# Altium project YYBpcb.PrjPcb
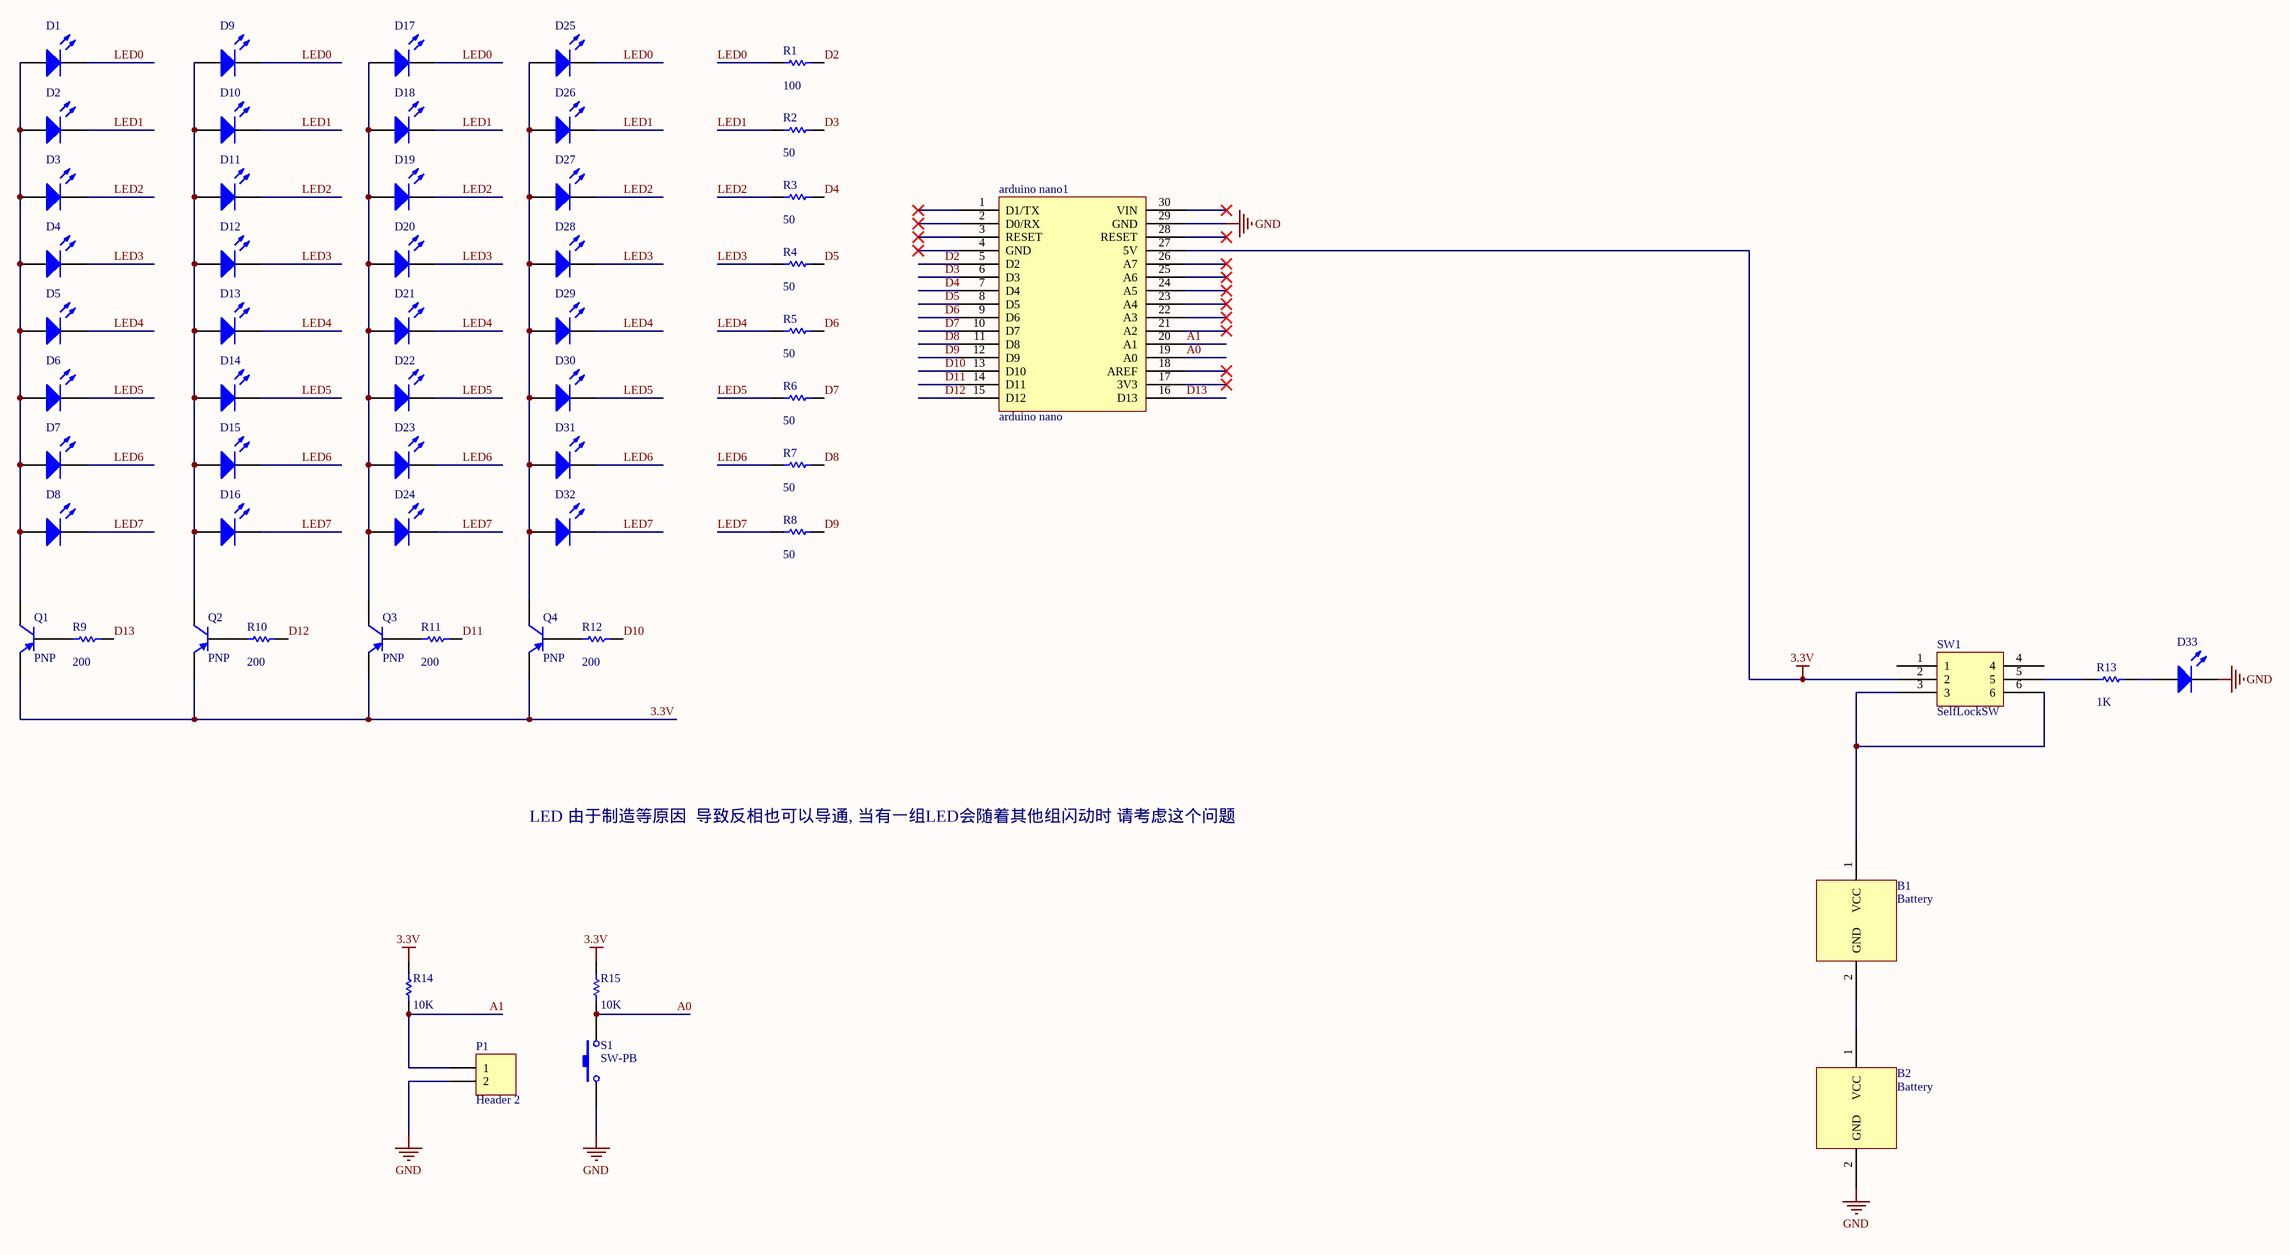
[diagram p0: Sheet3.SchDoc]
1 sheet, 58 parts. Net scope: global (net labels, ports and power ports of the same name join across sheets).
Board file: PCB1.PcbDoc

## Sheet Sheet3.SchDoc
size A2

### Parts
arduino_nano1  arduino nano  [arduino nano - duplicate]
B1  Battery  [battery]
B2  Battery  [battery]
D1  LED3  [3.5X2.8X1.9]  (value not drawn)
D2  LED3  [3.5X2.8X1.9]  (value not drawn)
D3  LED3  [3.5X2.8X1.9]  (value not drawn)
D4  LED3  [3.5X2.8X1.9]  (value not drawn)
D5  LED3  [3.5X2.8X1.9]  (value not drawn)
D6  LED3  [3.5X2.8X1.9]  (value not drawn)
D7  LED3  [3.5X2.8X1.9]  (value not drawn)
D8  LED3  [3.5X2.8X1.9]  (value not drawn)
D9  LED3  [3.5X2.8X1.9]  (value not drawn)
D10  LED3  [3.5X2.8X1.9]  (value not drawn)
D11  LED3  [3.5X2.8X1.9]  (value not drawn)
D12  LED3  [3.5X2.8X1.9]  (value not drawn)
D13  LED3  [3.5X2.8X1.9]  (value not drawn)
D14  LED3  [3.5X2.8X1.9]  (value not drawn)
D15  LED3  [3.5X2.8X1.9]  (value not drawn)
D16  LED3  [3.5X2.8X1.9]  (value not drawn)
D17  LED3  [3.5X2.8X1.9]  (value not drawn)
D18  LED3  [3.5X2.8X1.9]  (value not drawn)
D19  LED3  [3.5X2.8X1.9]  (value not drawn)
D20  LED3  [3.5X2.8X1.9]  (value not drawn)
D21  LED3  [3.5X2.8X1.9]  (value not drawn)
D22  LED3  [3.5X2.8X1.9]  (value not drawn)
D23  LED3  [3.5X2.8X1.9]  (value not drawn)
D24  LED3  [3.5X2.8X1.9]  (value not drawn)
D25  LED3  [3.5X2.8X1.9]  (value not drawn)
D26  LED3  [3.5X2.8X1.9]  (value not drawn)
D27  LED3  [3.5X2.8X1.9]  (value not drawn)
D28  LED3  [3.5X2.8X1.9]  (value not drawn)
D29  LED3  [3.5X2.8X1.9]  (value not drawn)
D30  LED3  [3.5X2.8X1.9]  (value not drawn)
D31  LED3  [3.5X2.8X1.9]  (value not drawn)
D32  LED3  [3.5X2.8X1.9]  (value not drawn)
D33  LED3  [6-0805_N]  (value not drawn)
P1  Header 2  [HDR1X2]
Q1  PNP  [LC-SOT-23(SOT-23-3)]
Q2  PNP  [LC-SOT-23(SOT-23-3)]
Q3  PNP  [LC-SOT-23(SOT-23-3)]
Q4  PNP  [LC-SOT-23(SOT-23-3)]
R1  value 100  [6-0805_N]
R2  value 50  [6-0805_N]
R3  value 50  [6-0805_N]
R4  value 50  [6-0805_N]
R5  value 50  [6-0805_N]
R6  value 50  [6-0805_N]
R7  value 50  [6-0805_N]
R8  value 50  [6-0805_N]
R9  value 200  [6-0805_N]
R10  value 200  [6-0805_N]
R11  value 200  [6-0805_N]
R12  value 200  [6-0805_N]
R13  value 1K  [6-0805_N]
R14  value 10K  [6-0805_N]
R15  value 10K  [6-0805_N]
S1  SW-PB  [贴片开关]
SW1  SelfLockSW  [sw0 - duplicate]

### Nets
3.3V: arduino_nano1.27(5V) Q1.3(C) Q2.3(B) Q3.3(B) Q4.3(B) R14.2 R15.2 SW1.2
GND: arduino_nano1.29(GND) B2.2(GND) D33.2(K) P1.2 S1.1
A0: arduino_nano1.19(A0) R15.1 S1.2
A1: arduino_nano1.20(A1) P1.1 R14.1
D2: arduino_nano1.5(D2) R1.2
D3: arduino_nano1.6(D3) R2.2
D4: arduino_nano1.7(D4) R3.2
D5: arduino_nano1.8(D5) R4.2
D6: arduino_nano1.9(D6) R5.2
D7: arduino_nano1.10(D7) R6.2
D8: arduino_nano1.11(D8) R7.2
D9: arduino_nano1.12(D9) R8.2
D10: arduino_nano1.13(D10) R12.2
D11: arduino_nano1.14(D11) R11.2
D12: arduino_nano1.15(D12) R10.2
D13: arduino_nano1.16(D13) R9.2
LED0: D1.2(K) D9.2(K) D17.2(K) D25.2(K) R1.1
LED1: D2.2(K) D10.2(K) D18.2(K) D26.2(K) R2.1
LED2: D3.2(K) D11.2(K) D19.2(K) D27.2(K) R3.1
LED3: D4.2(K) D12.2(K) D20.2(K) D28.2(K) R4.1
LED4: D5.2(K) D13.2(K) D21.2(K) D29.2(K) R5.1
LED5: D6.2(K) D14.2(K) D22.2(K) D30.2(K) R6.1
LED6: D7.2(K) D15.2(K) D23.2(K) D31.2(K) R7.1
LED7: D8.2(K) D16.2(K) D24.2(K) D32.2(K) R8.1
NetB1_1: B1.1(VCC) SW1.3 SW1.6
NetB1_2: B1.2(GND) B2.1(VCC)
NetD1_1: D1.1(A) D2.1(A) D3.1(A) D4.1(A) D5.1(A) D6.1(A) D7.1(A) D8.1(A) Q1.1(B)
NetD9_1: D9.1(A) D10.1(A) D11.1(A) D12.1(A) D13.1(A) D14.1(A) D15.1(A) D16.1(A) Q2.1(C)
NetD17_1: D17.1(A) D18.1(A) D19.1(A) D20.1(A) D21.1(A) D22.1(A) D23.1(A) D24.1(A) Q3.1(C)
NetD25_1: D25.1(A) D26.1(A) D27.1(A) D28.1(A) D29.1(A) D30.1(A) D31.1(A) D32.1(A) Q4.1(C)
NetD33_1: D33.1(A) R13.1
NetQ1_2: Q1.2(E) R9.1
NetQ2_2: Q2.2(E) R10.1
NetQ3_2: Q3.2(E) R11.1
NetQ4_2: Q4.2(E) R12.1
NetR13_2: R13.2 SW1.5

Not connected (* = marked no-connect by the designer): arduino_nano1 1(D1/TX)* 2(D0/RX)* 3(RESET)* 4(GND)* 17(3V3)* 18(AREF)* 21(A2)* 22(A3)* 23(A4)* 24(A5)* 25(A6)* 26(A7)* 28(RESET)* 30(VIN)*; SW1 1 4

### Notes on the sheet
- LED 由于制造等原因  导致反相也可以导通, 当有一组LED会随着其他组闪动时 请考虑这个问题
- Title
- Size:
- Date:
- File:
- A2
- Number:
- Time:
- Revision:
- Sheet
- of

### Library data of the parts
arduino_nano1 = arduino
D1-D33 = LED3: Typical BLUE SiC LED; Published: 8-Jun-2000; LatestRevisionDate: 17-Dec-2003; LatestRevisionNote: PCB Footprint replaced.; DatasheetVersion: 16-Apr-2002; PackageVersion: 16-Apr-2002; PackageReference: 3.5X2.8X1.9; Publisher: Altium Limited; PackageDescription: SM LED; 2 C-Bend Leads; Body 3.5 x 2.8 x 1.9 mm, inc leads (LxWxH typ)
P1 = Header 2: Header, 2-Pin; LatestRevisionDate: 17-Jul-2002; LatestRevisionNote: Re-released for DXP Platform.; Publisher: Altium Limited
Q1-Q4 = PNP: PNP Bipolar Transistor; Published: 8-Jun-2000; LatestRevisionDate: 29-May-2009; LatestRevisionNote: IPC-7351 Footprint Added.; PackageVersion: Aug-1999; PackageReference: SOT-23B; Publisher: Altium Limited; PackageDescription: 3-Pin SOT-23 Package 0.95 mm Pitch, 2.4 mm Lead Span
R1-R15 = Res1: Resistor; Published: 8-Jun-2000; LatestRevisionDate: 17-Jul-2002; LatestRevisionNote: Re-released for DXP Platform.; PackageReference: AXIAL-0.3; Publisher: Altium Limited; PackageDescription: Axial Device, Thru-Hole; 2 Leads; 0.3 in Pin Spacing
S1 = SW-PB: Switch; Published: 24-Mar-1999; LatestRevisionDate: 17-Jul-2002; LatestRevisionNote: Re-released for DXP Platform.; PackageReference: SPST-2; Publisher: Altium Limited; PackageDescription: Switch; 2 Leads
SW1 = SW0